# EAGLE design pixel32 (EAGLE 7.7.0)
SCALE: 1:1; SCHEMATIC_NAME: RECO0.16.018.01.00.00.E3; STUDENT: D. Palamarčuks; THESIS_SUPERVISOR: I. Galkins

## Sheet 1 of 2
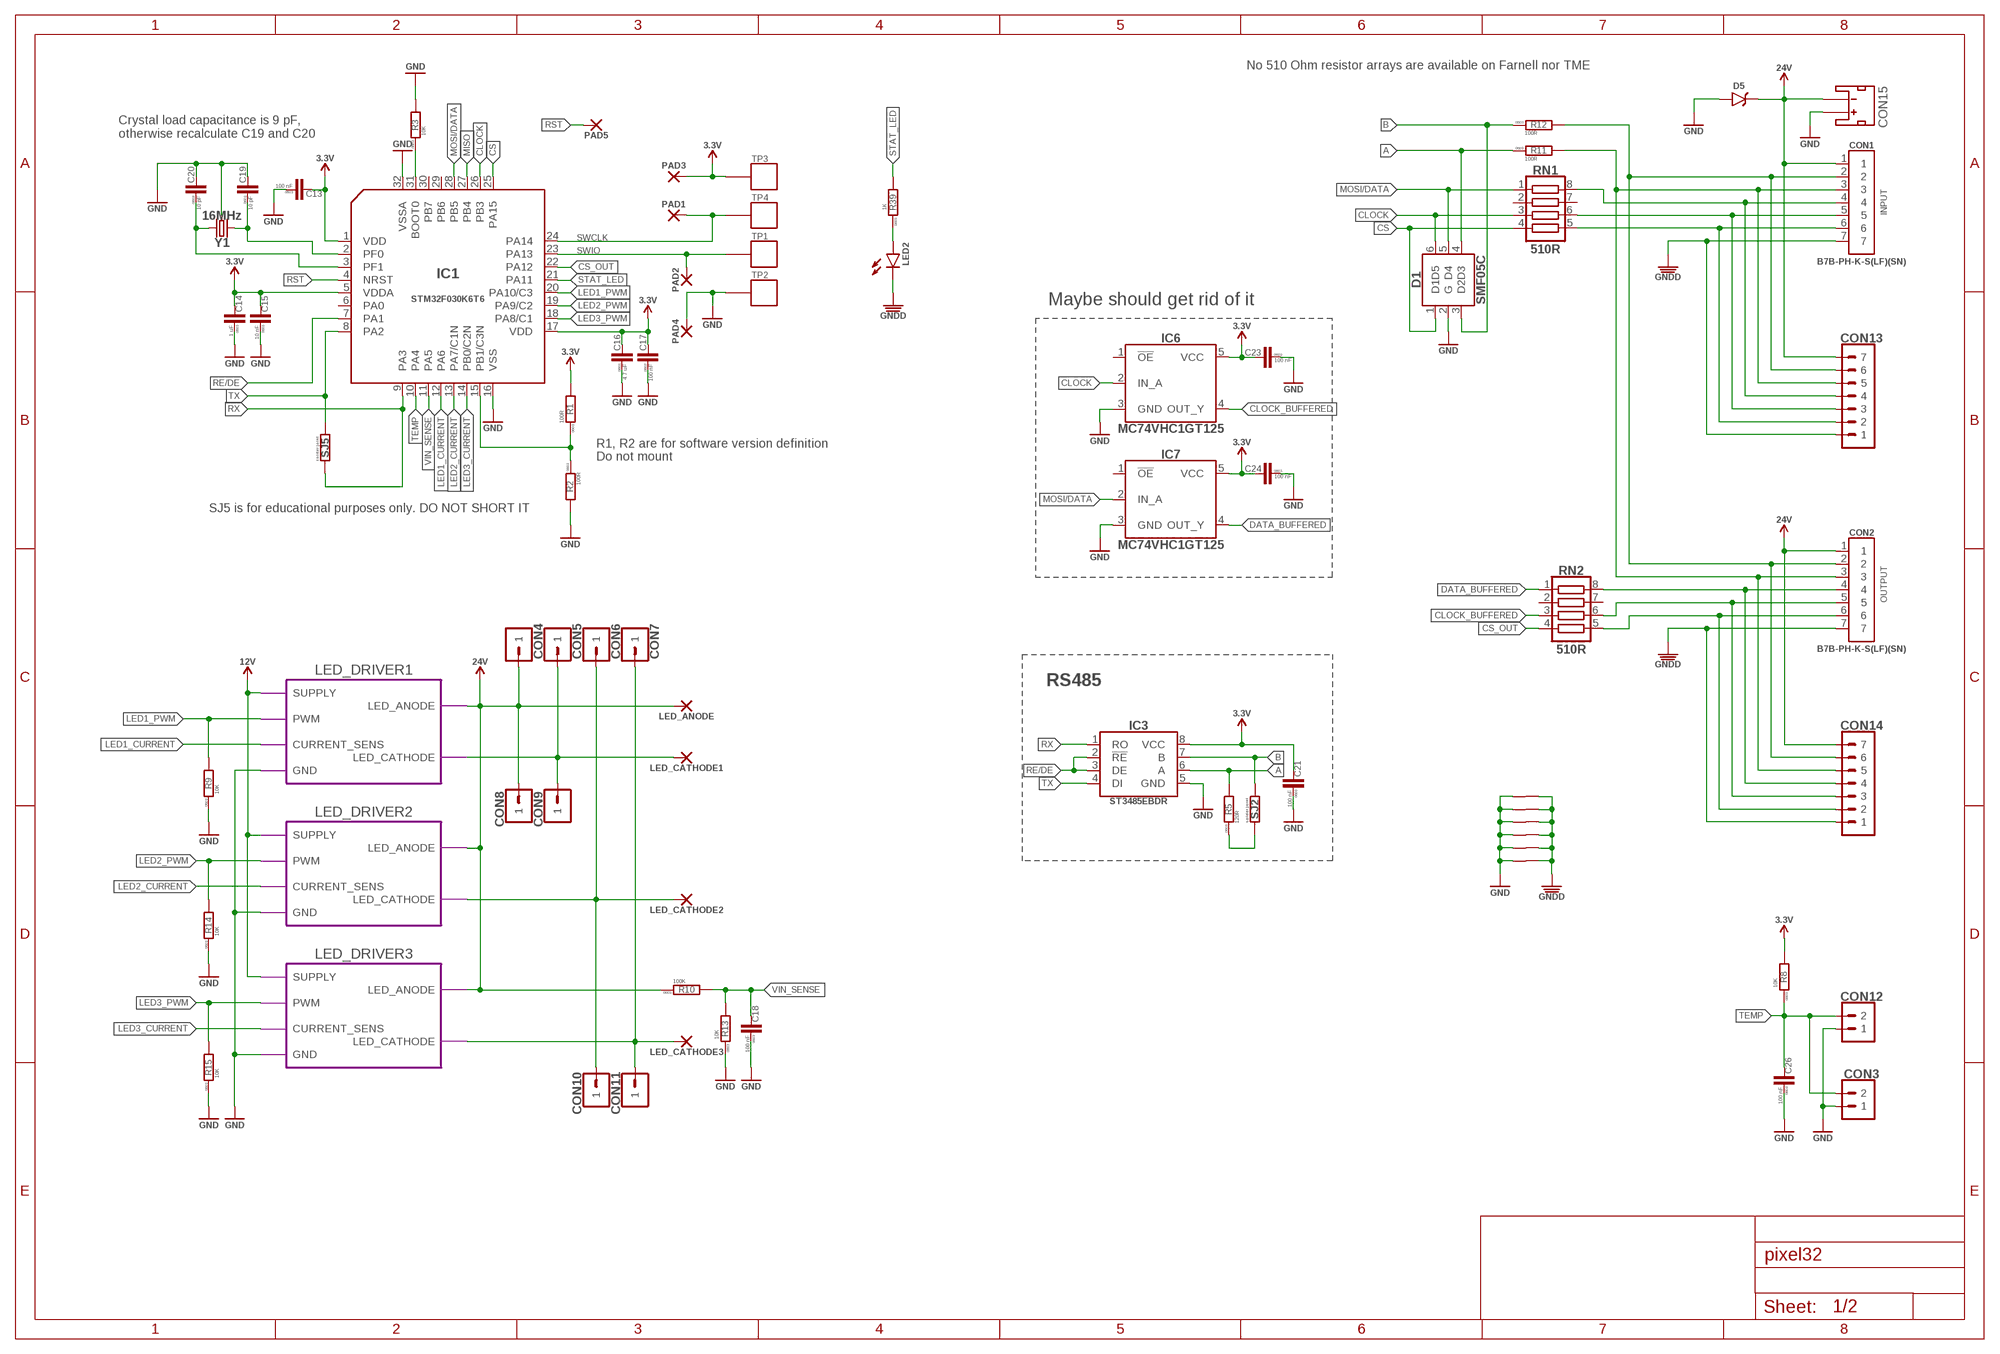
[diagram p0: schematic, sheet 1]

### Parts
C13  100 nF  C-0603  [C0603]
C14  1 uF  C-0603  [C0603]
C15  10 nF  C-0603  [C0603]
C16  4.7 uF  C-0603  [C0603]
C17  100 nF  C-0603  [C0603]
C18  100 nF  C-0603  [C0603]
C19  10 pF  C-0603  [C0603]
C20  10 pF  C-0603  [C0603]
C21  100 nF  C-0603  [C0603]
C23  100 nF  C-0603  [C0603]
C24  100 nF  C-0603  [C0603]
C26  100 nF  C-0603  [C0603]
CON1  B7B-PH-K-S-SIDE  [B7B-PH-K-S_SIDE]
CON2  B7B-PH-K-S-SIDE  [B7B-PH-K-S_SIDE]
CON3  PINHEAD_1X02-2.54  [1X02-PTH-2.54]
CON4  PINHEAD_1X01-2.54  [1X01-PTH-2.54]
CON5  PINHEAD_1X01-2.54  [1X01-PTH-2.54]
CON6  PINHEAD_1X01-2.54  [1X01-PTH-2.54]
CON7  PINHEAD_1X01-2.54  [1X01-PTH-2.54]
CON8  PINHEAD_1X01-2.54  [1X01-PTH-2.54]
CON9  PINHEAD_1X01-2.54  [1X01-PTH-2.54]
CON10  PINHEAD_1X01-2.54  [1X01-PTH-2.54]
CON11  PINHEAD_1X01-2.54  [1X01-PTH-2.54]
CON12  PINHEAD_1X02-2.54  [1X02-PTH-2.54]
CON13  PINHEAD_1X07-2  [1X07-PTH-2]
CON14  PINHEAD_1X07-2  [1X07-PTH-2]
CON15  B2B-PH-K-S  [B2B-PH-K-S_SIDE_MOUNT]
D1  SMF05C  [SC70_6L]
D5  TVS_DIODE-SMB  [SMB]
IC1  STM32F030K6TX-LQFP32(7X7)  [LQFP32-7X7]
IC3  ST3485SOIC8  [SOIC8]
IC6  MC74VHC1GT125  [SOT23-5]
IC7  MC74VHC1GT125  [SOT23-5]
LED2  LED-0603  [LED0603]
LED_ANODE  WIREPADSMD2.5-1.8  [PAD-2.5-1.8]
LED_CATHODE1  WIREPADSMD2.5-1.8  [PAD-2.5-1.8]
LED_CATHODE2  WIREPADSMD2.5-1.8  [PAD-2.5-1.8]
LED_CATHODE3  WIREPADSMD2.5-1.8  [PAD-2.5-1.8]
PAD1  WIREPADSMD2.5-1.8  [PAD-2.5-1.8]
PAD2  WIREPADSMD2.5-1.8  [PAD-2.5-1.8]
PAD3  WIREPADSMD2.5-1.8  [PAD-2.5-1.8]
PAD4  WIREPADSMD2.5-1.8  [PAD-2.5-1.8]
PAD5  WIREPADSMD2.5-1.8  [PAD-2.5-1.8]
R1  100R  R-0603  [R0603]
R2  100R  R-0603  [R0603]
R3  10K  R-0603  [R0603]
R5  120R  R-0603  [R0603]
R8  10K  R-0603  [R0603]
R9  10K  R-0603  [R0603]
R10  100K  R-0603  [R0603]
R11  100R  R-0603  [R0603]
R12  100R  R-0603  [R0603]
R13  10K  R-0603  [R0603]
R14  10K  R-0603  [R0603]
R15  10K  R-0603  [R0603]
R39  1K  R-0603  [R0603]
RN1  510R  RESISTOR_ARRAY  [CAT16-J4]
RN2  510R  RESISTOR_ARRAY  [CAT16-J4]
SJ2  SOLDER_JOINT  [RES_0]
SJ5  SOLDER_JOINT  [RES_0]
TP1  PAD.05  [PAD.05X.05]
TP2  PAD.05  [PAD.05X.05]
TP3  PAD.05  [PAD.05X.05]
TP4  PAD.05  [PAD.05X.05]
U$3  CONNECTION  [CONNECTION]
U$6  CONNECTION  [CONNECTION]
U$7  CONNECTION  [CONNECTION]
U$8  CONNECTION  [CONNECTION]
U$9  CONNECTION  [CONNECTION]
U$10  CONNECTION  [CONNECTION]
Y1  16MHz  CRYSTAL-3.2X2.5-4P  [OSCILLATOR-3.2X2.5]

### Module instances
LED_DRIVER1 = LED_DRIVER (part numbers offset by 100)
LED_DRIVER2 = LED_DRIVER (part numbers offset by 200)
LED_DRIVER3 = LED_DRIVER (part numbers offset by 300)

### Nets
A: D1.4(D3) IC3.6(A) R5.2 R11.1
B: D1.3(D2) IC3.7(B) R12.1 SJ2.1
CLOCK: D1.6(D5) IC1.26(PB3) IC6.2(IN_A) RN1.3
CLOCK_BUFFERED: IC6.4(OUT_Y) RN2.3
CS: D1.1(D1) IC1.25(PA15) RN1.4
CS_OUT: IC1.22(PA12) RN2.4
DATA_BUFFERED: IC7.4(OUT_Y) RN2.1
GND: C13.1 C14.1 C15.1 C16.1 C17.1 C18.1 C19.2 C20.2 C21.1 C23.1 C24.1 C26.1 CON3.1 CON12.1 CON15.1(+) D1.2(G) D5.A IC1.16(VSS) IC1.32(VSSA) IC3.5(GND) IC6.3(GND) IC7.3(GND) PAD4.P$1(P) R2.2 R3.2 R9.1 R13.1 R14.1 R15.1 TP2.P$1 U$3.P$2 U$6.P$2 U$7.P$2 U$8.P$2 U$9.P$2 U$10.P$2 Y1.2(GND) Y1.4(GND) ; port LED_DRIVER1.GND LED_DRIVER3.GND LED_DRIVER2.GND ; also sheet 2
GNDD: CON1.7 CON2.7 CON13.1 CON14.1 LED2.C U$3.P$1 U$6.P$1 U$7.P$1 U$8.P$1 U$9.P$1 U$10.P$1
LED1_CURRENT: IC1.12(PA6) ; port LED_DRIVER1.CURRENT_SENS
LED1_PWM: IC1.20(PA10/C3) R9.2 ; port LED_DRIVER1.PWM
LED2_CURRENT: IC1.13(PA7/C1N) ; port LED_DRIVER2.CURRENT_SENS
LED2_PWM: IC1.19(PA9/C2) R14.2 ; port LED_DRIVER2.PWM
LED3_CURRENT: IC1.14(PB0/C2N) ; port LED_DRIVER3.CURRENT_SENS
LED3_PWM: IC1.18(PA8/C1) R15.2 ; port LED_DRIVER3.PWM
MISO: IC1.27(PB4)
MOSI/DATA: D1.5(D4) IC1.28(PB5) IC7.2(IN_A) RN1.1
N$1: R5.1 SJ2.2
N$3: IC1.15(PB1/C3N) R1.1 R2.1
N$4: C19.1 IC1.2(PF0) Y1.1
N$6: IC1.31(BOOT0) R3.1
N$9: C20.1 IC1.3(PF1) Y1.3
N$10: CON5.1 CON9.1 LED_CATHODE1.P$1(P) ; port LED_DRIVER1.LED_CATHODE
N$11: CON1.4 CON13.4 RN1.8
N$12: CON1.5 CON13.3 RN1.6
N$13: CON1.6 CON13.2 RN1.5
N$14: CON2.4 CON14.4 RN2.8
N$15: CON2.5 CON14.3 RN2.6
N$19: CON2.6 CON14.2 RN2.5
N$21: CON6.1 CON10.1 LED_CATHODE2.P$1(P) ; port LED_DRIVER2.LED_CATHODE
N$22: LED2.A R39.1
N$23: CON7.1 CON11.1 LED_CATHODE3.P$1(P) ; port LED_DRIVER3.LED_CATHODE
RE/DE: IC1.7(PA1) IC3.2(!RE) IC3.3(DE)
RS485_A: CON1.2 CON2.2 CON13.6 CON14.6 R12.2
RS485_B: CON1.3 CON2.3 CON13.5 CON14.5 R11.2
RST: IC1.4(NRST) PAD5.P$1(P)
RX: IC1.9(PA3) IC3.1(RO) SJ5.2
STAT_LED: IC1.21(PA11) R39.2
SWCLK: IC1.24(PA14) PAD1.P$1(P) TP4.P$1
SWIO: IC1.23(PA13) PAD2.P$1(P) TP1.P$1
TEMP: C26.2 CON3.2 CON12.2 IC1.10(PA4) R8.1
TX: IC1.8(PA2) IC3.4(DI) SJ5.1
VDD_3V3: C13.2 C14.2 C15.2 C16.2 C17.2 C21.2 C23.2 C24.2 IC1.1(VDD) IC1.5(VDDA) IC1.17(VDD) IC3.8(VCC) IC6.5(VCC) IC7.5(VCC) PAD3.P$1(P) R1.2 R8.2 TP3.P$1 ; supply symbol labelled 3.3V ; also sheet 2
VDD_12V: port LED_DRIVER2.SUPPLY LED_DRIVER1.SUPPLY LED_DRIVER3.SUPPLY ; supply symbol labelled 12V ; also sheet 2
VDD_24V: CON1.1 CON2.1 CON4.1 CON8.1 CON13.7 CON14.7 CON15.2(-) D5.C LED_ANODE.P$1(P) R10.1 ; port LED_DRIVER1.LED_ANODE LED_DRIVER3.LED_ANODE LED_DRIVER2.LED_ANODE ; supply symbol labelled 24V ; also sheet 2
VIN_SENSE: C18.2 IC1.11(PA5) R10.2 R13.2
Unconnected: IC1.6(PA0) IC1.29(PB6) IC1.30(PB7) IC6.1(!OE) IC7.1(!OE) RN1.2 RN1.7 RN2.2 RN2.7

### Notes on the sheet
- No 510 Ohm resistor arrays are available on Farnell nor TME
- Crystal load capacitance is 9 pF,
  otherwise recalculate C19 and C20
- INPUT
- Maybe should get rid of it
- R1, R2 are for software version definition
- Do not mount
- SJ5 is for educational purposes only. DO NOT SHORT IT
- OUTPUT
- RS485

## Sheet 2 of 2: DC-DC converter
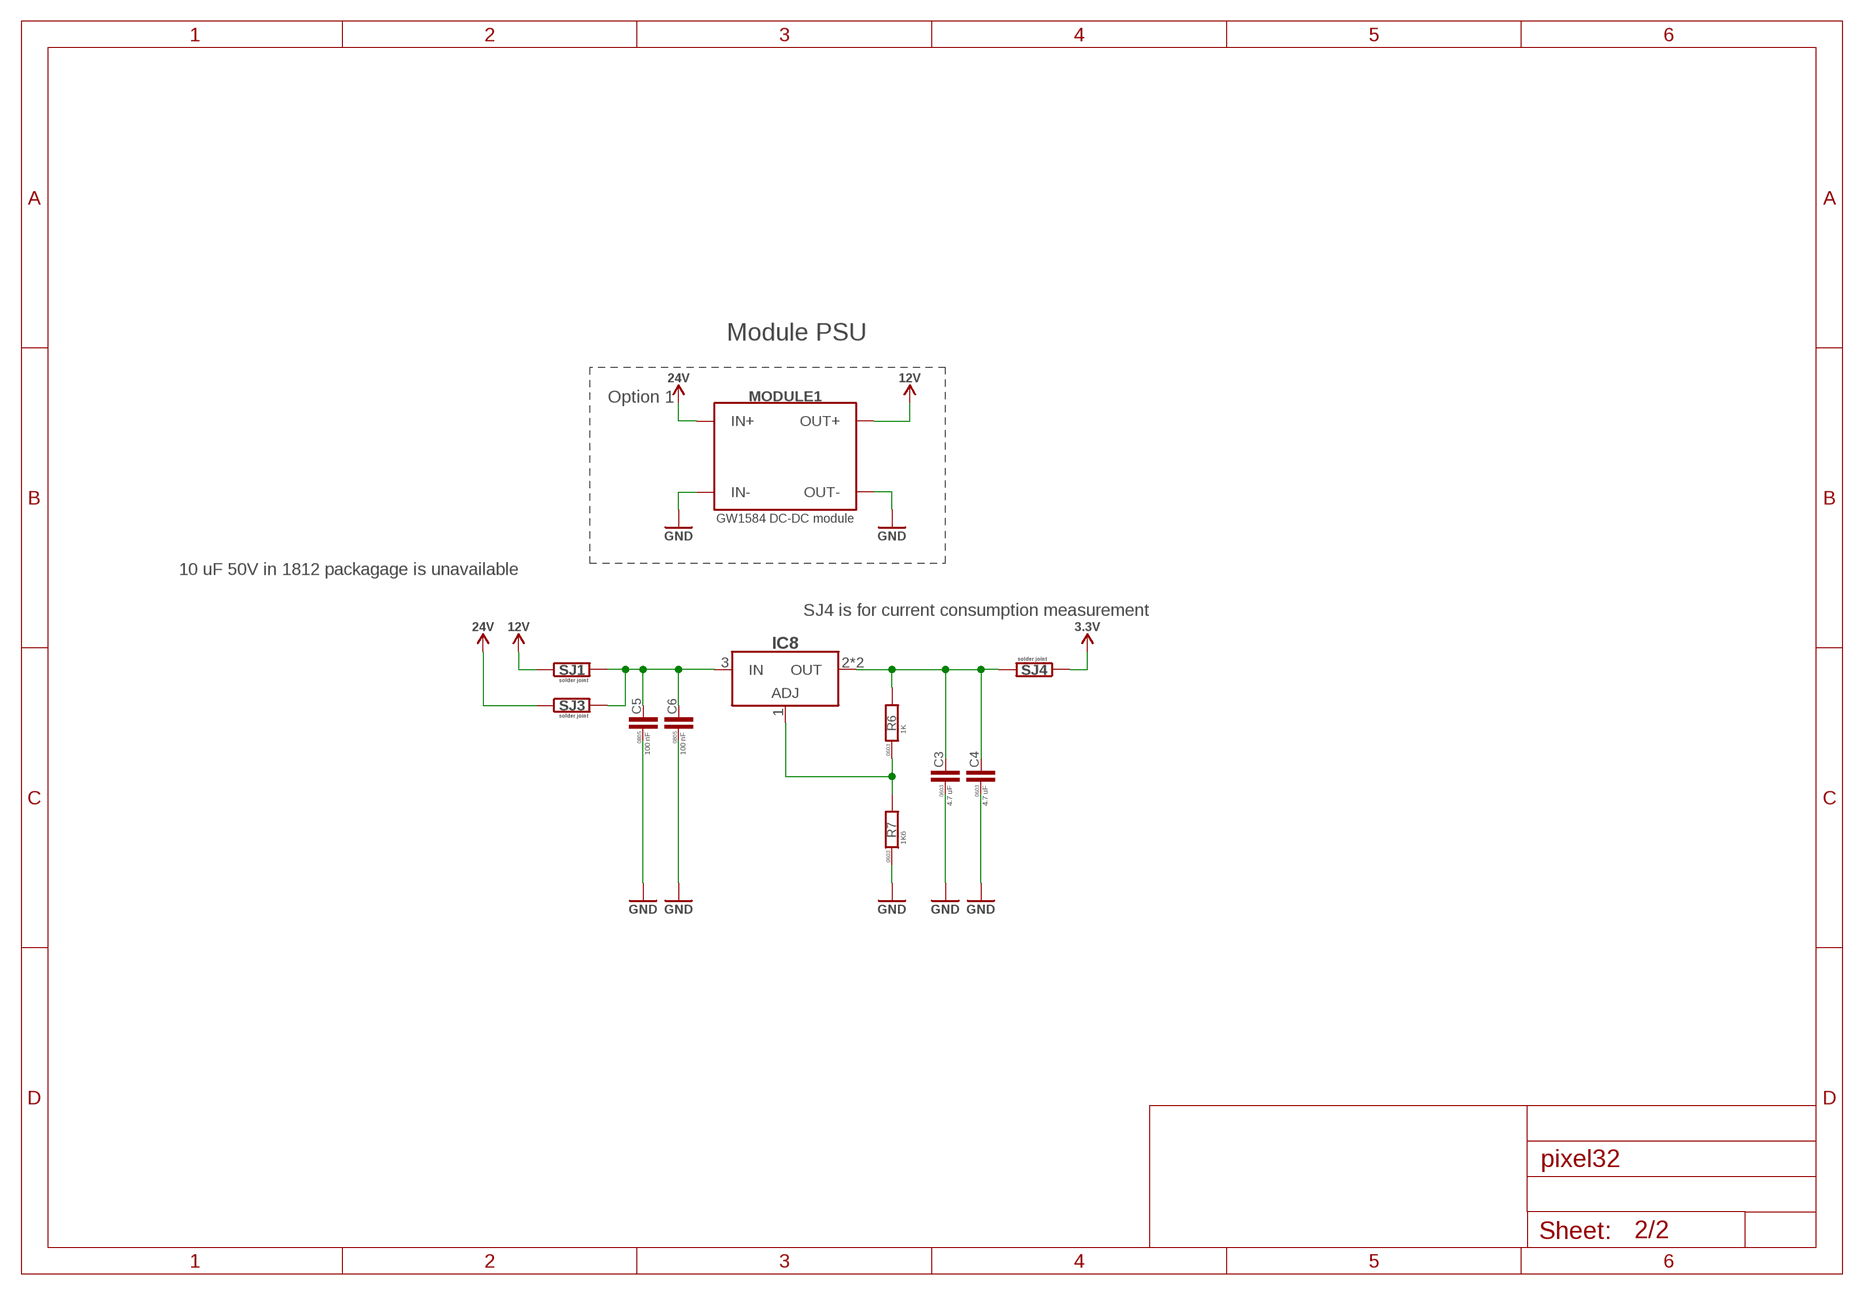
[diagram p1: schematic, sheet 2]

### Parts
C3  4.7 uF  C-0603  [C0603]
C4  4.7 uF  C-0603  [C0603]
C5  100 nF  C-0805  [C0805]
C6  100 nF  C-0805  [C0805]
IC8  LM317  [SOT223]
MODULE1  GW1584  [GW1584]
R6  1K  R-0603  [R0603]
R7  1K6  R-0603  [R0603]
SJ1  SOLDER_JOINT  [RES_0]
SJ3  SOLDER_JOINT  [RES_0]
SJ4  SOLDER_JOINT  [RES_0]

### Nets
GND: C3.1 C4.1 C5.1 C6.1 MODULE1.IN-@1(IN-) MODULE1.IN-@2(IN-) MODULE1.OUT-@1(OUT-) MODULE1.OUT-@2(OUT-) R7.1 ; also sheet 1
N$2: C3.2 C4.2 IC8.2(OUT) IC8.4(OUT) R6.2 SJ4.2
N$5: C5.2 C6.2 IC8.3(IN) SJ1.2 SJ3.2
N$20: IC8.1(ADJ) R6.1 R7.2
VDD_3V3: SJ4.1 ; supply symbol labelled 3.3V ; also sheet 1
VDD_12V: MODULE1.OUT+@1(OUT+) MODULE1.OUT+@2(OUT+) SJ1.1 ; supply symbol labelled 12V ; also sheet 1
VDD_24V: MODULE1.IN+@1(IN+) MODULE1.IN+@2(IN+) SJ3.1 ; supply symbol labelled 24V ; also sheet 1

### Notes on the sheet
- Module PSU
- Option 1
- 10 uF 50V in 1812 packagage is unavailable
- SJ4 is for current consumption measurement

## Library data of the parts
C3 C4 C16 = rc:C; FARNELL#: 2496930; PACKAGE: 0603; TME#: GRM188R60J475KE19D
C5 C6 = rc:C; FARNELL#: 2496834; PACKAGE: 0805; TME#: GRM188R71H104KA93D
C13 C17 C18 C21 C23 C24 C26 = rc:C; FARNELL#: 2496834; PACKAGE: 0603; TME#: GRM188R71H104KA93D
C14 = rc:C; FARNELL#: 2496917; PACKAGE: 0603; TME#: GRM188R61C105KA93D
C15 = rc:C; FARNELL#: 2496827; PACKAGE: 0603; TME#: C0603C103K3RAC
C19 C20 = rc:C; FARNELL#: 1414601; PACKAGE: 0603; TME#: GRM1885C1H100JA01D
CON1 CON2 = pixel_masterlib:B7B-PH-K-S: 7 Positions Header Connector 2.00mm, Through Hole, Side SMD; CHIPDIP#: 9000325603; DIGIKEY#: 455-1709-ND; FARNELL#: 9491864; MANF#: B7B-PH-K-S(LF)(SN); TME#: B7B-PH-K-S
CON3 CON12 = pinhead:PINHEAD_1X02: pinheader 2P
CON4-CON11 = pinhead:PINHEAD_1X01: pinheader 1P
CON13 CON14 = pinhead:PINHEAD_1X07: pinheader 7P
CON15 = led_matrix_master_lib:B2B-PH-K-S: CONN HEADER PH TOP 2POS 2MM
D1 = pixel_masterlib:SMF05C; CHIPDIP#: 9000048448; DIGIKEY#: SMF05CCT-ND; FARNELL#: 2059033; MANF: Semtech Corporation; MANF#: SMF05C.TCT; TME#: SMF05CT1G
D5 = pixel_masterlib:TVS_DIODE; CHIPDIP#: 8023193826; DIGIKEY#: 497-15658-2-ND; FARNELL#: 1749366; MANF: STMicroelectronics; MANF#: SMBJ26CA; TME#: SMBJ26CA-LF
IC1 = pixel_masterlib:STM32F030K6TX: MCU 32BIT 32KB FLASH 32LQFP; CHIPDIP#: 9000250493; DIGIKEY#: 497-14046-ND; FARNELL#: 2432085; MANF: STMicroelectronics; MANF#: STM32F030K6T6; TME#: STM32F030K6T6
IC3 = pixel_masterlib:ST3485: IC TXRX 3.3V RS485/422 8 SOIC; CHIPDIP#: 9000220421; DIGIKEY#: 497-2080-1-ND; FARNELL#: 2253266; MANF: STMicroelectronics; MANF#: ST3485EBDR; TME#: ST3485EBD
IC6 IC7 = pixel_masterlib:MC74VHC1GT125: Buffer, Non-Inverting 1 Element 1 Bit per Element Push-Pull Output 5-TSOP; CHIPDIP#: 9000014391; DIGIKEY#: MC74VHC1GT125DT1GOSDKR-ND; FARNELL#: 2101847; MANF: ON Semiconductor; MANF#: MC74VHC1GT125
IC8 = pixel_masterlib:LM317: Linear Voltage Regulator IC Positive Adjustable 1 Output 1.2 V ~ 37 V 500mA SOT-223; CHIPDIP#: LM317DCY; DIGIKEY#: 296-23224-5-ND; FARNELL#: 2112605; MANF: Texas Instruments; MANF#: LM317MSTT3G; TME#: LM317DCY
LED2 = rc:LED: SMD LED; CHIPDIP#: 8598509892; COLOR: GREEN; DIGIKEY#: 160-1446-1-ND; FARNELL#: 2293494; MANF: Lite-On Inc; MANF#: LTST-C191KGKT; TME#: LTST-C191KGKT
LED_ANODE LED_CATHODE1-LED_CATHODE3 PAD1-PAD5 = wirepad:WIREPAD: Wire PAD connect wire on PCB; BOM: EXCLUDE
MODULE1 = pixel_masterlib:GW1584: THIS http://mysku.ru/blog/aliexpress/35938.html http://ru.aliexpress.com/item/New-Mini-Converter-Adjustable-DC-DC-Step-down-Power-Supply-Module-replace-LM2596/32411413046.html?spm=2114.30010708.3.314.AhmzLw&s=p&ws_ab_test=searchweb201556_6,searchweb201602_5_10017_10010_10011_10018_10019_10036_10035_10034_301_507_10033_10032_10020_10001_10002_10005_10006_10021_10003_10022_10004_401_10009_10007_10008_2030013,searchweb201603_9&btsid=8a54b1af-cc82-4f8d-a784-d3b67147a089
R1 R2 = rc:R; ASSY: DO NOT MOUNT; PACKAGE: 0603
R3 R8 R9 R13-R15 = rc:R; FARNELL#: 2008341; PACKAGE: 0603; TME#: RC0603FR-0710K
R5 = rc:R; FARNELL#: 2303067; PACKAGE: 0603; TME#: CRCW0603120RFKTABC
R6 R39 = rc:R; FARNELL#: 2303145; PACKAGE: 0603; TME#: RC0603FR-071K
R7 = rc:R; FARNELL#: 2303159; PACKAGE: 0603; TME#: RC0603FR-071K6
R10 = rc:R; FARNELL#: 2303232; PACKAGE: 0603; TME#: RC0603FR-07100K
R11 R12 = rc:R; FARNELL#: 2303059; PACKAGE: 0603; TME#: RC0603FR-07100R
RN1 RN2 = pixel_masterlib:RESISTOR_ARRAY: Chip Resistor Array 4 Single Resistor; CHIPDIP#: 9000044911; DIGIKEY#: CAT16-511J4LF-ND; FARNELL#: 2321730; MANF: Bourns Inc; MANF#: CAT16-511J4LF
SJ1-SJ5 = eth_conv_master_lib:SOLDER_JOINT; BOM: EXCLUDE
TP1-TP4 = misc:PAD: Test pad This footprint includes three classes: The actual test pads, a pogo-pin footprint to mount the pogo-pin as through-hole part and a hole footprint which allows the head of the pogo-pin to pass through (do NOT use the hole to mount the pogo-pin). In a typical test setup, the stack would consist of three PCBs: The actual PCB under testing with a test pad on the bottom, then a second PCB with the hole for the pogo-pin head where the PCB under testing is pressed on and a third PCB at 30 mm / 1.2" distance with the pogo-pin footprints. The pogo-pins are soldered to the last PCB. To create the stack, copy the board under testing and exchange the footprints - this way the correct positioning is ensured.; BOM: EXCLUDE; PARTNO: *
U$3 U$6-U$10 = usb2can_master_lib:CONNECTION; BOM: EXCLUDE
Y1 = crystals:CRYSTAL: Smd Crystal; CHIPDIP#: 8596067027; DIGIKEY#: SER4069CT-ND; FARNELL#: 1712841; MANF: Epson; MANF#: X1E0000210013 TSX-3225 16 MHZ 9.0PF

## Module LED_DRIVER
Ports: GND(pwr) PWM(in) CURRENT_SENS(out) LED_ANODE(pwr) LED_CATHODE(pwr) SUPPLY(pwr)
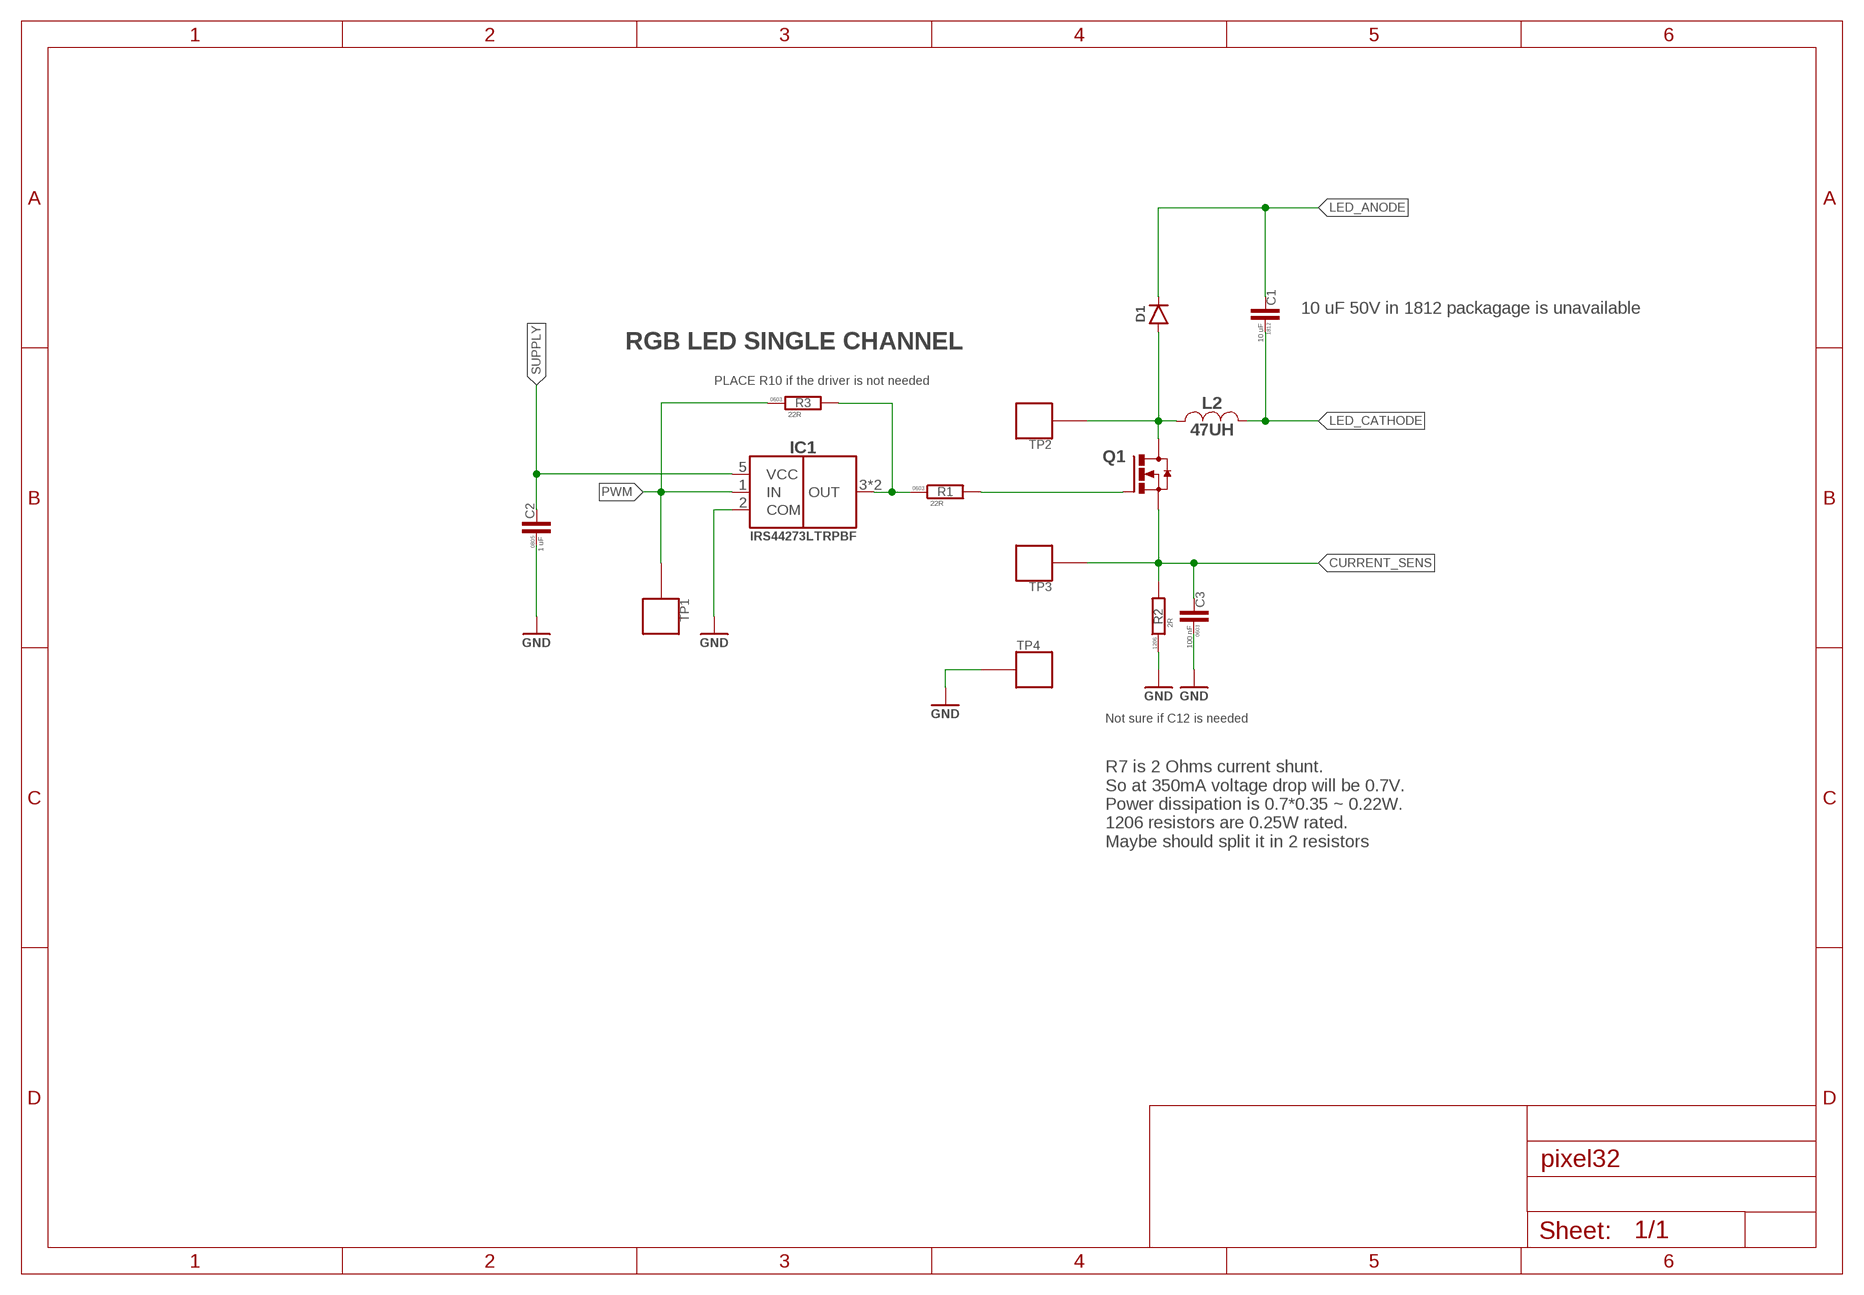
[diagram p2: schematic, module LED_DRIVER, sheet 1]

### Parts
C1  10 uF  C-1812  [C1812]
C2  1 uF  C-0805  [C0805]
C3  100 nF  C-0603  [C0603]
D1  DIODE-SOD123  [SOD123]
IC1  IRS44273L  [SOT23-5]
L2  47UH  INDUCTOR-470KL-SDR0805  [SDR0805]
Q1  N-FET-SOT23  [SOT23-3]
R1  22R  R-0603  [R0603]
R2  2R  R-R1206  [R1206]
R3  22R  R-0603  [R0603]
TP1  PAD.05  [PAD.05X.05]
TP2  PAD.05  [PAD.05X.05]
TP3  PAD.05  [PAD.05X.05]
TP4  PAD.05  [PAD.05X.05]

### Nets
CURRENT_SENS: C3.2 Q1.2(S) R2.P$2 TP3.P$1
GND: C2.1 C3.1 IC1.2(COM) R2.P$1 TP4.P$1
LED_ANODE: C1.P$2 D1.C
LED_CATHODE: C1.P$1 L2.2
N$2: D1.A L2.1 Q1.3(D) TP2.P$1
N$3: IC1.3(OUT) IC1.4(OUT) R1.1 R3.2
N$7: Q1.1(G) R1.2
PWM: IC1.1(IN) R3.1 TP1.P$1
SUPPLY: C2.2 IC1.5(VCC)

### Notes on the sheet
- 10 uF 50V in 1812 packagage is unavailable
- RGB LED SINGLE CHANNEL
- PLACE R10 if the driver is not needed
- Not sure if C12 is needed
- R7 is 2 Ohms current shunt. 
  So at 350mA voltage drop will be 0.7V. 
  Power dissipation is 0.7*0.35 ~ 0.22W. 
  1206 resistors are 0.25W rated. 
  Maybe should split it in 2 resistors

### Library data of the parts
C1 = rc:C; FARNELL#: 2449143; PACKAGE: 1812; TME#: CL32B106KBJNNNE
C2 = rc:C; FARNELL#: 1735541; PACKAGE: 0805; TME#: GRM21BR71H105KA12L
C3 = rc:C; FARNELL#: 2496834; PACKAGE: 0603; TME#: GRM188R71H104KA93D
D1 = pixel_masterlib:DIODE; CHIPDIP#: MBRS1100T3G; DIGIKEY#: MBRS1100T3GOSCT-ND; FARNELL#: 9555862; MANF: ON Semiconductor; MANF#: MBRS1100T3G; TME#: MBRS1100T3G
IC1 = pixel_masterlib:IRS44273L: Low-Side Gate Driver IC Non-Inverting SOT-23-5; CHIPDIP#: 9000204261; DIGIKEY#: IRS44273LTRPBFTR-ND; FARNELL#: 2580779; MANF: Infineon Technologies; MANF#: IRS44273LTRPBF; TME#: IRS44273LTRPBF
L2 = power_inductors:INDUCTOR: Unshielded Wirewound Inductor; CHIPDIP#: 8980699057; DIGIKEY#: SDR0805-470KLCT-ND; FARNELL#: 1828030; MANF: Bourns Inc; MANF#: SDR0805-470KL
Q1 = pixel_masterlib:N-FET; CHIPDIP#: 9000095041; DIGIKEY#: IRLML0040TRPBFCT-ND; FARNELL#: 1831088; MANF: Infineon Technologies; MANF#: IRLML0040TRPBF; TME#: IRLML0040TRPBF
R1 R3 = rc:R; FARNELL#: 2302996; PACKAGE: 0603; TME#: CRCW060322R0FKEA
R2 = rc:R; FARNELL#: 2502621; PACKAGE: 1206; TME#: RC1206FR-072R
TP1-TP4 = pixhawk2:PAD: Test pad This footprint includes three classes: The actual test pads, a pogo-pin footprint to mount the pogo-pin as through-hole part and a hole footprint which allows the head of the pogo-pin to pass through (do NOT use the hole to mount the pogo-pin). In a typical test setup, the stack would consist of three PCBs: The actual PCB under testing with a test pad on the bottom, then a second PCB with the hole for the pogo-pin head where the PCB under testing is pressed on and a third PCB at 30 mm / 1.2" distance with the pogo-pin footprints. The pogo-pins are soldered to the last PCB. To create the stack, copy the board under testing and exchange the footprints - this way the correct positioning is ensured.; BOM: EXCLUDE; PARTNO: *

## Net classes
4 USBpair: width 0.152 mm, drill 0.305 mm, clearance 0.152 mm

## Board
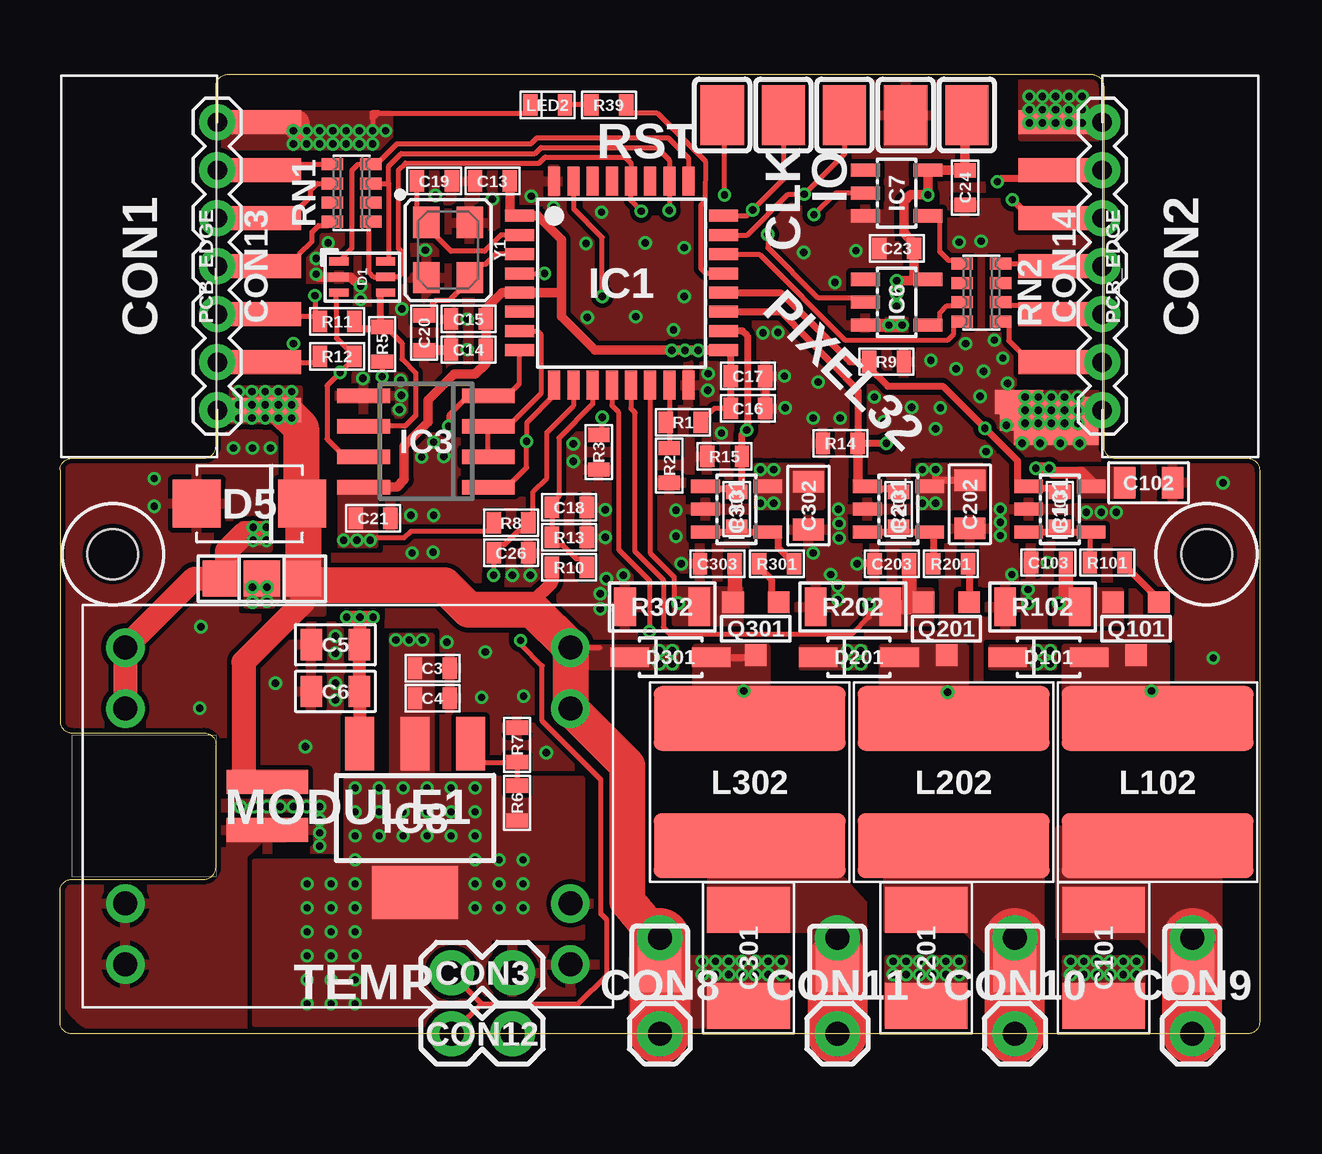
[diagram p3: board, top side]
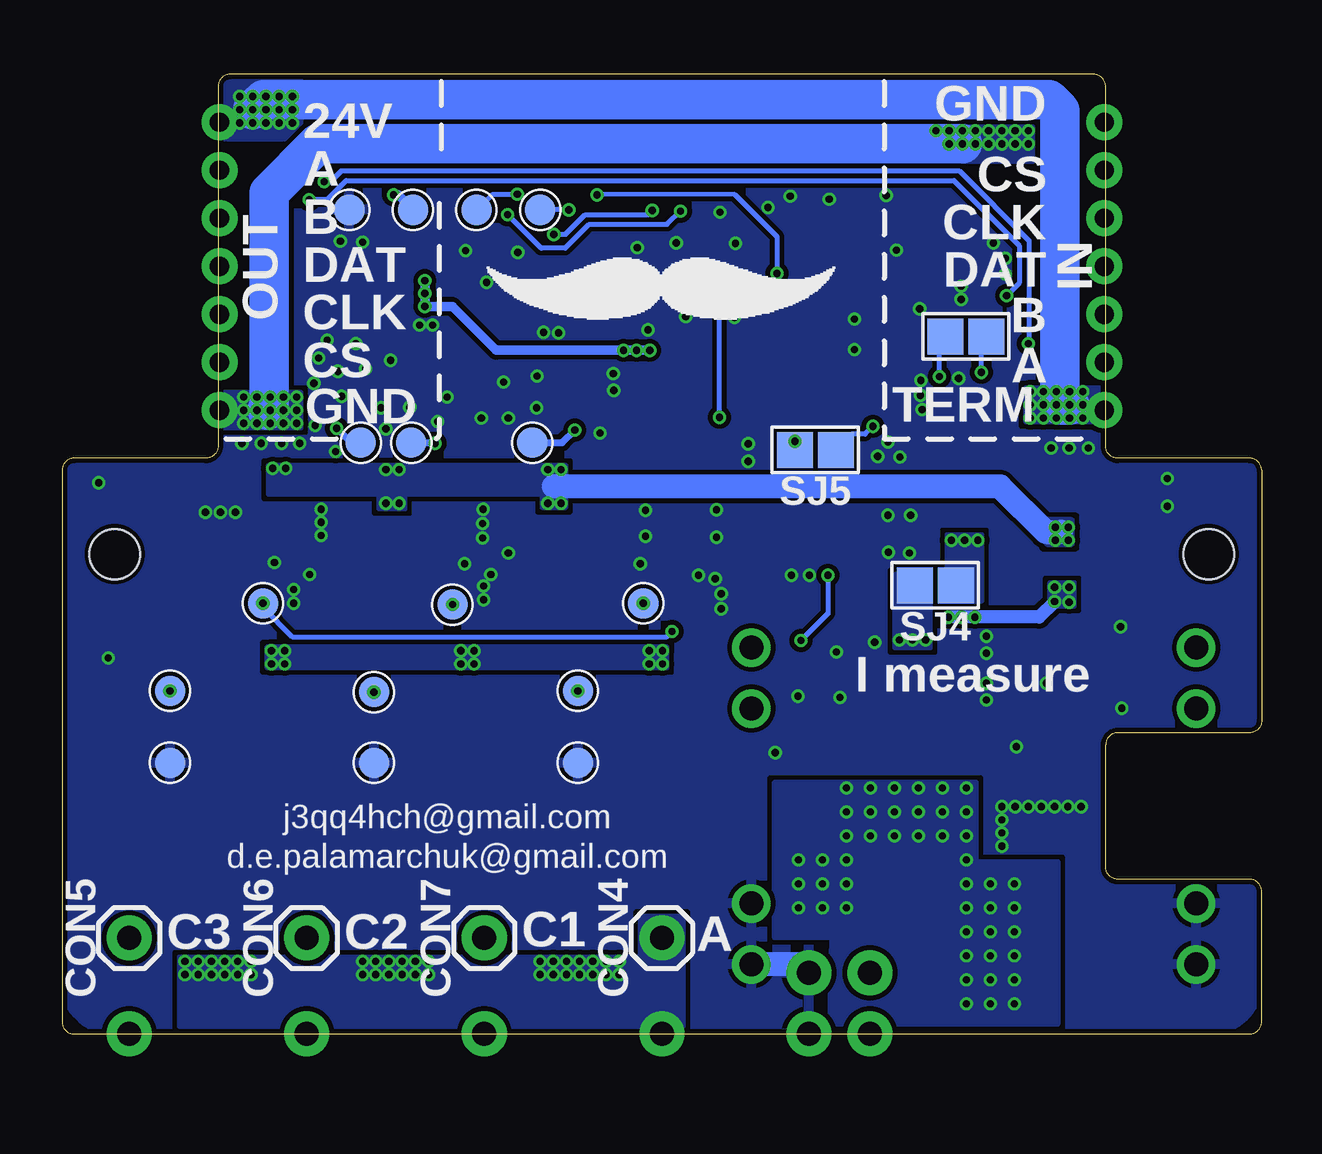
[diagram p4: board, bottom side, seen from below]

Size 50 x 40 mm. Coordinates in mm from the lower left corner, seen from the top.
Copper layers (1*16): Top 0.035mm / dielectric 0.5mm / Bottom 0.035mm
Design rules "design_rules *": minimum track width 0.2mm, minimum drill 0.2mm, track to track 0.2mm, track to pad 0.2mm, pad to pad 0.2mm, via to via 0.2mm, smd to smd 0.15mm, copper to edge 0.2mm, drill to drill 0.2mm, minimum pad ring 0.125mm, minimum via ring 0.125mm, stop-mask expansion 1mil, vias tented up to drill 0.31mm, thermal gap 8mil
tRestrict: 1 lines
Milling: 12 lines

### Footprints (pad centres in the part's own frame; a part is rotated, then mirrored left to right if it is on the bottom)
C0603 = smd 0.6 x 0.9: 1 -0.725,0; 2 0.725,0
C0805 = smd 0.9 x 1.3: 1 -1,0; 2 1,0
C1812 = smd 1.9 x 3.45: P$1 -2,0; P$2 2,0
B7B-PH-K-S_SIDE = smd 1 x 3: 1 -6,-0.25; 2 -4,-0.25; 3 -2,-0.25; 4 0,-0.25; 5 2,-0.25; 6 4,-0.25; 7 6,-0.25
1X02-PTH-2.54 = drill 1 pad 1.88: 1 -1.27,0; 2 1.27,0
1X01-PTH-2.54 = drill 1 pad 1.88: 1 0,0
1X07-PTH-2 = drill 0.8 pad 1.5: 1 -6,0; 2 -4,0; 3 -2,0; 4 0,0; 5 2,0; 6 4,0; 7 6,0
B2B-PH-K-S_SIDE_MOUNT = smd 1 x 3.4: 1 -1,-2.15; 2 1,-2.15
SC70_6L = smd 0.8 x 0.35: 1 -0.975,0.65; 2 -0.975,0; 3 -0.975,-0.65; 4 0.975,-0.65; 5 0.975,0; 6 0.975,0.65
SMB = smd 2 x 2: A -2.2,0; C 2.2,0
SOD123 = smd 1.6 x 0.8: A 1.7,0; C -1.7,0
LQFP32-7X7 = smd 1.2 x 0.5: 1 -4.25,2.8; 2 -4.25,2; 3 -4.25,1.2; 4 -4.25,0.4; 5 -4.25,-0.4; 6 -4.25,-1.2; 7 -4.25,-2; 8 -4.25,-2.8; 17 4.25,-2.8; 18 4.25,-2; 19 4.25,-1.2; 20 4.25,-0.4; 21 4.25,0.4; 22 4.25,1.2; 23 4.25,2; 24 4.25,2.8 | smd 0.5 x 1.2: 9 -2.8,-4.25; 10 -2,-4.25; 11 -1.2,-4.25; 12 -0.4,-4.25; 13 0.4,-4.25; 14 1.2,-4.25; 15 2,-4.25; 16 2.8,-4.25; 25 2.8,4.25; 26 2,4.25; 27 1.2,4.25; 28 0.4,4.25; 29 -0.4,4.25; 30 -1.2,4.25; 31 -2,4.25; 32 -2.8,4.25
SOIC8 = smd 2.2 x 0.6: 1 -2.6,1.905; 2 -2.6,0.635; 3 -2.6,-0.635; 4 -2.6,-1.905; 5 2.6,-1.905; 6 2.6,-0.635; 7 2.6,0.635; 8 2.6,1.905
SOT23-5 = smd 0.55 x 1.2: 1 -0.95,-1.3; 2 0,-1.3; 3 0.95,-1.3; 4 0.95,1.3; 5 -0.95,1.3
SOT223 = smd 1.219 x 2.235: 1 -2.311,-3.099; 2 0,-3.099; 3 2.311,-3.099 | smd 3.6 x 2.2: 4 0,3.099
SDR0805 = smd 2.7 x 8: 1 -2.65,0; 2 2.65,0
LED0603 = smd 0.6 x 0.9: A -0.725,0; C 0.725,0
PAD-2.5-1.8 = smd 1.8 x 2.5: P$1 0,0
GW1584 = drill 1 pad 1.6: IN+@1 9.271,6.604; IN+@2 9.271,4.064; IN-@1 9.271,-6.604; IN-@2 9.271,-4.064; OUT+@1 -9.271,6.604; OUT+@2 -9.271,4.064; OUT-@1 -9.271,-4.064; OUT-@2 -9.271,-6.604
SOT23-3 = smd 0.9 x 0.9: 1 -0.95,-1.1; 2 0.95,-1.1; 3 0,1.1
R0603 = smd 0.6 x 0.9: 1 -0.725,0; 2 0.725,0
R1206 = smd 0.9 x 1.6: P$1 -1.55,0; P$2 1.55,0
CAT16-J4 = smd 0.5 x 0.9: 1 -1.2,-0.8; 2 -0.4,-0.8; 3 0.4,-0.8; 4 1.2,-0.8; 5 1.2,0.8; 6 0.4,0.8; 7 -0.4,0.8; 8 -1.2,0.8
RES_0 = smd 1.5 x 1.5: 1 -0.85,0; 2 0.85,0
PAD.05X.05 = smd 1.27 x 1.27: P$1 0,0
CONNECTION = smd 1 x 1: P$1 -0.5,0; P$2 0.5,0
MOUNTING_HOLE_M2 = hole 2.1: 0,0
OSCILLATOR-3.2X2.5 = smd 1.3 x 1.1: 1 -1.15,-0.9; 2 1.15,-0.9; 3 1.15,0.9; 4 -1.15,0.9

### Placement (x,y rotation side)
C3  15.53,15.25 180 top
C4  15.53,14 180 top
C5  11.47,16.23 0 top
C6  11.47,14.28 0 top
C13  18.02,35.55 0 top
C14  17.02,28.52 0 top
C15  17.02,29.8 0 top
C16  28.68,26.07 180 top
C17  28.68,27.43 180 top
C18  21.23,21.95 180 top
C19  15.6,35.55 0 top
C20  15.18,29.23 270 top
C21  13.05,21.5 180 top
C23  34.88,32.75 0 top
C24  37.73,35.27 90 top
C26  18.8,20.05 180 top
C101  10 uF  [C1812]  43.5,3.18 270 top
C102  1 uF  [C0805]  45.38,22.98 180 top
C103  100 nF  [C0603]  41.2,19.65 0 top
C201  10 uF  [C1812]  36.1,3.18 270 top
C202  1 uF  [C0805]  37.92,22.07 90 top
C203  100 nF  [C0603]  34.67,19.6 0 top
C301  10 uF  [C1812]  28.7,3.18 270 top
C302  1 uF  [C0805]  31.2,22.02 90 top
C303  100 nF  [C0603]  27.4,19.6 0 top
CON1  8.3,32 90 top
CON2  41.7,32 270 top
CON3  17.6,2.55 180 top
CON4  25,4 90 bottom
CON5  47.2,4 90 bottom
CON6  39.8,4 90 bottom
CON7  32.4,4 90 bottom
CON8  25,0.01 0 top
CON9  47.2,0.01 0 top
CON10  39.8,0.01 0 top
CON11  32.4,0.01 0 top
CON12  17.6,0.01 180 top
CON13  6.56,32 270 top
CON14  43.44,32 90 top
CON15  6.5,9.5 90 top
D1  12.6,31.55 0 top
D5  7.9,22.1 0 top
D101  DIODE-SOD123  [SOD123]  41.2,15.7 0 top
D201  DIODE-SOD123  [SOD123]  33.3,15.7 0 top
D301  DIODE-SOD123  [SOD123]  25.45,15.7 0 top
DRILEGEND  [DRILEGEND]  -12.04,-13.2 0 top  (outside the outline)
IC1  23.4,31.3 0 top
IC3  15.25,24.7 180 top
IC6  34.88,30.5 270 top
IC7  34.88,35.05 270 top
IC8  14.8,9 180 top
IC101  IRS44273L  [SOT23-5]  41.67,21.88 270 top
IC201  IRS44273L  [SOT23-5]  34.95,21.88 270 top
IC301  IRS44273L  [SOT23-5]  28.2,21.88 270 top
L102  47UH  [SDR0805]  45.75,10.5 270 top
L202  47UH  [SDR0805]  37.25,10.5 270 top
L302  47UH  [SDR0805]  28.75,10.5 270 top
LED2  20.32,38.73 180 top
LED_ANODE  25,3 0 top
LED_CATHODE1  47.2,3 0 top
LED_CATHODE2  39.8,3 0 top
LED_CATHODE3  32.4,3 0 top
MODULE1  12,9.5 0 top
PAD1  30.15,38.3 0 top
PAD2  32.7,38.3 0 top
PAD3  37.8,38.3 0 top
PAD4  35.25,38.3 0 top
PAD5  27.6,38.3 0 top
Q101  N-FET-SOT23  [SOT23-3]  44.85,16.9 180 top
Q201  N-FET-SOT23  [SOT23-3]  36.95,16.9 180 top
Q301  N-FET-SOT23  [SOT23-3]  29,16.9 180 top
R1  25.98,25.5 0 top
R2  25.4,23.7 270 top
R3  22.45,24.25 270 top
R5  13.43,28.75 90 top
R6  19.05,9.62 270 top
R7  19.05,12.05 270 top
R8  18.8,21.3 180 top
R9  34.45,28.02 180 top
R10  21.23,19.45 0 top
R11  11.55,29.7 180 top
R12  11.55,28.25 180 top
R13  21.23,20.7 180 top
R14  32.52,24.62 0 top
R15  27.7,24.07 0 top
R39  22.88,38.73 0 top
R101  22R  [R0603]  43.65,19.65 0 top
R102  2R  [R1206]  40.95,17.8 0 top
R103  22R  [R0603]  41.67,21.88 270 top
R201  22R  [R0603]  37.12,19.6 0 top
R202  2R  [R1206]  33.05,17.8 0 top
R203  22R  [R0603]  34.95,21.88 270 top
R301  22R  [R0603]  29.88,19.6 180 top
R302  2R  [R1206]  25.1,17.8 0 top
R303  22R  [R0603]  28.2,21.88 270 top
RN1  12.15,35.05 90 top
RN2  38.4,30.9 270 top
SJ1  7.55,18.98 0 top
SJ2  12.32,29.07 180 bottom
SJ3  9.28,18.98 180 top
SJ4  13.6,18.7 180 bottom
SJ5  18.6,24.35 180 bottom
TP1  32.73,34.35 90 bottom
TP2  38.02,34.35 90 bottom
TP3  35.38,34.35 90 bottom
TP4  30.07,34.35 90 bottom
TP101  PAD.05  [PAD.05X.05]  37.55,24.65 270 bottom
TP102  PAD.05  [PAD.05X.05]  45.5,14.3 180 bottom
TP103  PAD.05  [PAD.05X.05]  41.62,17.95 180 bottom
TP104  PAD.05  [PAD.05X.05]  45.5,11.3 180 bottom
TP201  PAD.05  [PAD.05X.05]  35.45,24.65 270 bottom
TP202  PAD.05  [PAD.05X.05]  37,14.25 180 bottom
TP203  PAD.05  [PAD.05X.05]  33.73,17.9 180 bottom
TP204  PAD.05  [PAD.05X.05]  37,11.3 180 bottom
TP301  PAD.05  [PAD.05X.05]  30.4,24.65 270 bottom
TP302  PAD.05  [PAD.05X.05]  28.5,14.3 180 bottom
TP303  PAD.05  [PAD.05X.05]  25.77,17.95 180 bottom
TP304  PAD.05  [PAD.05X.05]  28.5,11.3 180 bottom
U$1  [MOUSTASHE]  32.5,29.4 0 bottom
U$2  [BOARD_OUTLINE]  25,20 0 top
U$3  40.17,25.65 180 top
U$4  [MOUNTING_HOLE_M2]  2.2,20 0 top
U$5  [MOUNTING_HOLE_M2]  47.8,20 0 top
U$6  39.98,26.35 180 top
U$7  41.25,25.55 270 top
U$8  40.25,25.55 270 top
U$9  42.25,25.55 270 top
U$10  42.77,25.55 270 top
Y1  16.18,32.67 270 top

### Tracks (layer width: path | path; a pad name or v marks a point on that pad's centre or on a via)
A
  Top 0.2: 13.43,29.45 R5.2 13.57,29.48 14.25,28.8 14.25,28.12 14.82,27.55 14.82,25.77 14.38,25.34 IC3.6
  Top 0.3: 13.65,29.35 R5.2 | D1.4 13.35,30.9 13.35,29.5 R5.2 | R11.1 12.28,29.4 13.43,29.4 R5.2
B  (via drill 0.3)
  Top 0.2: D1.3 11.5,30.82 11.5,30.65 11.53,29 R12.1 12.28,28.15 12.25,28.15 v11.68,27.57 11.12,27.02 11.12,24.8 11.86,24.07 IC3.7
  Bottom 0.2: v11.68,27.57 11.68,28.85 SJ2.1
CLOCK  (via drill 0.3)
  Top 0.2: 13.65,32.2 D1.6 13.7,32.2 13.7,35.45 | RN1.3 13.7,35.45 | v25.4,34.33 IC1.26 25.4,36.42 24.88,36.95 20.05,36.95 19.8,36.7 14.22,36.7 13.7,36.17 13.7,35.45 | v29.5,33.33 29.5,32.77 31.6,30.68 33.4,30.68 IC6.2
  Bottom 0.2: v25.4,34.33 25.57,34.15 28.2,34.15 29.02,33.33 v29.5,33.33
CLOCK_BUFFERED
  Top 0.2: IC6.4 36.67,29.55 36.67,30.05 36.98,30.35 37.6,30.35 RN2.3
CS
  Top 0.2: 13.18,36.25 RN1.4 | 12.68,36.25 RN1.4 | IC1.25 26.2,36.5 25.35,37.35 19.88,37.35 19.62,37.1 14.05,37.1 13.3,36.35 13.3,36.25 RN1.4 | D1.1 12.18,32.75 12.18,36 12.43,36.25 RN1.4
CS_OUT
  Top 0.2: IC1.22 27.68,32.48 29.18,32.48 32.73,28.93 37,28.93 37.25,29.18 37.25,29.7 RN2.4 37.52,29.7
DATA_BUFFERED
  Top 0.2: 36.55,34.1 IC7.4 36.33,33.95 36.67,33.95 36.67,32.6 37.02,32.25 37.45,32.25 RN2.1 37.25,32.1
GND  (via drill 0.3, 0.3 pad 0.55)
  Top 0.2: IC1.32 20.6,35.23
  Top 0.3: C203.1 v33.23,19.6 | C17.1 C16.1
  Top 0.4: v12.53,31.18 12.38,31.3 12.1,31.55 10.78,31.55 | C20.2 16.27,28.5
  Top 0.55: IC6.3 v34.55,29.55 v35.1,29.55
  Bottom 1: CON3.1 19.22,2.9 MODULE1.IN-@1
  other vias: 39.2,21.88 41.15,19.65 32.45,21.88 31.4,20.05 10.68,32.33 11.18,32.98 12.53,30.62 32.42,18.68 32.42,18.1 40.35,18.52 40.35,17.95 39.67,19.15 25.9,19.6 30.2,27.43 27.02,27.52 32.12,19.15 19.65,34.92 44.02,21.75 22.57,34.25 31.4,25.68 22.52,18.35 23.48,19.12 18.02,34.8 15.65,34.95 15.22,32.67 16.98,29.8 16.98,28.52 21.4,23.88 25.68,20.75 25.68,21.82 42.77,21.75 43.4,21.75 27.57,25.05 27,26.82 14.22,26.62 14.15,26.02 14.2,27.25 15.57,24.68 3.93,22 3.93,23.15 20.57,34.45 22.52,17.73 39.2,20.77 30.23,26.1 8.02,24.43 48.48,22.98 31,32.58 32.3,31.32 33.17,32.65 14.25,30.23 15.07,24.05 16,24.07 14.62,21.62 15.57,21.62 32.48,21.27 32.48,20.68 39.2,21.32 25.57,29.35 21.98,29.88 35.5,26.12 36.5,25.23 33.95,26.55 36.7,26.1 22.73,21.85 22.73,20.7 22.77,18.98 21.4,24.6 29.3,29.23 29.93,29.25 26.02,32.77 32.52,25.68 12.62,27.32 37.48,33 38.4,33.05 7.23,24.43 8.77,24.43 18.85,19.12 19.6,19.12 14.68,20.05 15.55,20.07 10.68,31.68 48.08,15.68 21.93,32.95 24,29.9 24.4,32.98 26.02,30.75 39.45,25.38 39.5,27.12 39.3,28.18 38.95,28.93 38.5,27.62 37.35,27.73 38.35,26.57 37.75,28.77 36.3,28.07 42.5,24.62 41.7,24.62 40.85,24.62 40.1,24.62 34.35,25.52 31.6,27.18 38.6,24.27 11.47,13.93 11.47,14.62 11.47,15.88 11.47,16.57 7.52,9.47 8.07,9.47 8.62,9.47 9.18,9.47 9.72,9.47 10.28,9.47 10.82,9.47 10.82,8.93 10.82,8.38 10.82,7.82 8.98,14.62 10.22,11.97 5.82,13.57 5.88,16.98 17.73,15.93 17.57,14.03 19.32,14.07 16.12,16.32 20.27,11.72
  pour Bottom (isolate 0.2, rank 6): 50,2.5 50,37.5 arc90 47.5,40 2.5,40 arc90 0,37.5 0,2.5 arc90 2.5,0 47.5,0 arc90
  pour Top (rank 6): 0,2.5 0,37.5 arc-90 2.5,40 47.5,40 arc-90 50,37.5 50,2.5 arc-90 47.5,0 2.5,0 arc-90
  pour Top (no thermals): 34.45,37.35 36.05,37.35 36.08,36.73 34.67,35.55 34.67,32.02 32.17,32.02 32.17,33.75 32.7,34.27 34.45,34.27
  pour Top (no thermals): 9.4,8.1 9.4,8.9 7,8.9 7,6.9 7.7,6.9 7.7,7 7.7,7.4 8,7.7 8.4,8.1
GNDD  (via drill 0.3)
  Top 0.2: 13.03,38.15 v13.03,37.65 | 13.18,38.3 13.03,38.15 | 13.3,38.4 13,38.4 | 13.03,38.15 13.03,38.38 19.6,38.38 LED2.C
  Top 1: CON14.1 41.42,26 41.4,26.02 | CON13.1 9.9,38 9.9,37.7
  Bottom 0.3: 41.05,34.67 41.38,35
  Bottom 1.65: v12.47,37.1 39.35,37.1 41.38,35.08 41.38,35 41.38,26.07 CON2.7
  other vias: 11.38,37.65 9.72,37.1 10.28,37.1 10.82,37.1 11.38,37.1 11.93,37.1 11.93,37.65 10.82,37.65 10.28,37.65 9.72,37.65 40.23,26 41.33,25.45 41.88,25.45 42.42,25.45 40.23,25.45 40.77,25.45 40.77,26 40.23,26.55 40.77,26.55 42.42,26.55 42.42,26 41.88,26 41.33,26 41.33,26.55 41.88,26.55 12.47,37.65 13.03,37.1 13.57,37.65
  pour Top (no thermals): 6.65,38.4 13.78,38.4 13.78,36.92 6.65,36.92
  pour Bottom (no thermals): 13.75,37.83 9.55,37.83 9.55,36.35 13.75,36.35
  pour Top (no thermals): 40.17,26.75 43.4,26.75 43.4,25.25 40.17,25.25
  pour Bottom (no thermals): 43.4,26.75 40.05,26.75 40.05,25.25 43.4,25.25
LED1_CURRENT  (via drill 0.3)
  Top 0.2: C103.2 41.92,19.8 | IC1.12 23,26.2 23.3,25.9 23.3,20.18 24.57,18.9 v24.57,16.77
  Top 0.3: R102.P$2 42.67,17.98 | Q101.2 43.7,17.8
  Top 0.6: C103.2 41.92,17.8
  Bottom 0.2: v24.57,16.77 24.8,16.55 40.4,16.55 41.62,17.77 TP103.P$1
  other vias: 41.62,17.95
  pour Top (no thermals): 41.45,18.5 41.45,17.1 44.25,17.1 44.25,18.5
LED1_PWM  (via drill 0.3)
  Top 0.3: R103.1 41.55,22.73 40.38,22.73 IC101.1 39.92,22.82 39.92,23.88 v38.55,25.25 36.8,27 34.5,27 33.73,27.77 R9.2 32.92,28.02 30.05,30.9 IC1.20
  Bottom 0.3: TP101.P$1 37.25,24.65 | 37.45,24.65 TP101.P$1 | TP101.P$1 37.95,24.65 v38.55,25.25
LED2_CURRENT  (via drill 0.3)
  Top 0.2: C203.2 35.4,19.75 | IC1.13 23.8,26.07 23.98,25.9 23.98,20.1 25.15,18.93 25.15,16.95 25.43,16.68 33.02,16.68 33.73,17.38 TP203.P$1
  Top 0.6: C203.2 35.4,17.8 R202.P$2 34.6,17.75
  other vias: 33.73,17.9
  pour Top (no thermals): 33.55,18.5 33.55,17.1 36.35,17.1 36.35,18.5
LED2_PWM  (via drill 0.3)
  Top 0.3: IC201.1 33.75,22.73 34.95,22.73 R203.1 | IC1.19 30.05,30.1 33.25,26.85 R14.2 v34.45,24.62
  Top 0.4: R14.2 33.25,22.82 IC201.1
  Bottom 0.3: v34.45,24.62 35.42,24.62 TP201.P$1
LED3_CURRENT  (via drill 0.3)
  Top 0.2: C303.2 28.12,19.27 | Q301.2 28.05,18.2 28.12,18.2 | 26.32,18.5 26.65,18.18 R302.P$2 | 25.82,18 TP303.P$1 25.6,17.95 25.6,19.05 24.6,20.05 IC1.14
  Top 0.6: C303.2 28.12,18
  other vias: 25.77,17.95
  pour Top (no thermals): 25.6,18.55 25.6,17.1 28.4,17.1 28.4,18.55
LED3_PWM  (via drill 0.3)
  Top 0.2: 26.88,22.85 IC301.1
  Top 0.3: IC301.1 27,22.73 28.2,22.73 R303.1 | IC1.18 28.45,29.3 28.65,29.1 28.65,25.2 v28.62,25.18 28.43,24.98 R15.2 28.43,22.82 R303.1 | 27.93,22.6 R303.1
  Bottom 0.3: TP301.P$1 29.15,24.65 v28.62,25.18
LED_DRIVER1:N$2  (via drill 0.3)
  Top 0.3: L102.1 44.85,13.15
  other vias: 45.5,14.3
  pour Top (rank 3, no thermals): 46.17,12.32 46.17,16.15 41.85,16.15 41.85,12.32
LED_DRIVER1:N$3
  Top 0.2: IC101.4 42.92,20.88 R101.1
  Top 0.3: IC101.3 41.67,20.93 | 41.67,20.93 IC101.4 | R103.2 41.67,20.93
LED_DRIVER1:N$7
  Top 0.3: R101.2 44.38,19.52 45.8,18.1 Q101.1
LED_DRIVER2:N$2  (via drill 0.3)
  Top 0.3: L202.1 36.95,13.2
  other vias: 37,14.25
  pour Top (no thermals): 37.8,12.32 37.8,16.15 34.23,16.15 34.23,12.32
LED_DRIVER2:N$3
  Top 0.3: IC201.3 34.95,20.93 | 34.95,20.93 IC201.4 36.42,20.75 36.42,19.6 R201.1 | R203.2 34.95,20.93
LED_DRIVER2:N$7
  Top 0.2: 37.9,19.6 R201.2
  Top 0.3: 37.7,19.6 R201.2 | 37.9,19.6 Q201.1
LED_DRIVER3:N$2  (via drill 0.3)
  Top 0.3: 28.95,15.75 Q301.3 29,15.7 D301.A
  other vias: 28.5,14.3
  pour Top (no thermals): 29.52,12.32 29.52,16.15 26.45,16.15 26.45,12.32
LED_DRIVER3:N$3
  Top 0.3: R301.1 29.95,20.25 29.95,20.93 IC301.4 28.15,20.93 | IC301.3 28.15,20.93 | R303.2 28.2,20.98 28.15,20.93
LED_DRIVER3:N$7
  Top 0.3: R301.2 29.15,19.45 29.65,18.95 29.65,18 Q301.1
MOSI/DATA  (via drill 0.3)
  Top 0.2: v24.23,34.3 23.8,34.73 IC1.28 23.8,36.3 23.55,36.55 20.23,36.55 19.98,36.3 14.4,36.3 14.1,36 14.1,32.75 14.3,32.55 14.3,31.75 14.1,31.55 D1.5 13.07,31.55 12.88,31.75 12.88,33.77 RN1.1 | 33.4,34.88 IC7.2 32.35,35.05 v31.43,34.15
  Bottom 0.2: v24.23,34.3 24.77,33.75 28.02,33.75 29.02,32.75 30.02,32.75 v31.43,34.15
N$1  (via drill 0.3)
  Top 0.2: R5.1 v13.43,27.4
  Bottom 0.2: v13.43,27.4 13.43,28.82 SJ2.2
N$2  (via drill 0.3)
  other vias: 14,16.43 14.55,16.43 15.1,16.43 12.3,10.25 13.3,10.25 14.3,10.25 15.3,10.25 16.3,10.25 17.3,10.25 12.3,9.25 13.3,9.25 14.3,9.25 15.3,9.25 16.3,9.25 17.3,9.25 12.3,8.25 13.3,8.25 14.3,8.25 15.3,8.25 16.3,8.25 12.3,7.25 10.3,1.25 10.3,2.25 10.3,3.25 10.3,4.25 10.3,5.25 10.3,6.25 11.3,1.25 11.3,2.25 11.3,3.25 11.3,4.25 11.3,5.25 11.3,6.25 12.3,1.25 12.3,2.25 12.3,3.25 12.3,4.25 12.3,5.25 12.3,6.25 17.3,5.25 17.3,6.25 17.3,7.25 17.3,8.25 18.3,5.25 18.3,6.25 18.3,7.25 19.3,5.25 19.3,6.25 19.3,7.25
  pour Bottom (no thermals): 15.3,19.15 15.3,16.1 13.8,16.1 13.8,19.15
  pour Top (no thermals): 13.8,16.6 13.8,8.65 15.53,8.65 15.53,16.6
  pour Top (no thermals): 8.1,0.4 18,0.4 17.9,4 21.8,4 21.8,10.65 11.9,10.65 11.9,7.2 8.1,7.2
  pour Bottom (no thermals): 8.5,0.4 18,0.4 17.9,4 20.3,4 20.3,10.5 11.9,10.5 11.9,7.2 8.5,7.2
N$3
  Top 0.2: 25.23,25.48 R1.1 25.4,25.65 | 25.4,25.65 R2.1 25.4,24.4 | IC1.15 25.4,25.65
N$4
  Top 0.2: IC1.2 18.38,33.3 17.7,32.62 16.3,32.62 15.28,33.65 Y1.1 | 15.6,33.83 Y1.1 | Y1.1 14.88,34.23 C19.1
N$5  (via drill 0.3)
  Top 0.406: SJ1.2 SJ3.2
  Top 0.55: v12.5,17.38 12.5,16.25 C5.2 C6.2 12.49,14.26 12.49,12.68 | v12.5,17.38 v13.05,17.38 | v11.95,17.38 v12.5,17.38
  Top 0.9: IC8.3 12.49,12.68
  Bottom 0.55: v8.62,18.02 9.28,17.38 v13.05,17.38
  other vias: 8.02,18.62 8.62,18.62 8.02,18
  pour Top (no thermals): 9.07,19.62 9.07,17.82 7.75,17.82 7.75,19.62
  pour Bottom (no thermals): 7.82,18.82 7.82,17.82 8.82,17.82 8.82,18.82
N$6  (via drill 0.3)
  Top 0.2: R3.1 22.6,24.98 v22.6,25.7 | v22.6,30.75 22.6,33.2 21.43,34.38 IC1.31
  Bottom 0.2: v22.6,25.7 v22.6,30.75
N$9
  Top 0.2: IC1.3 18.15,32.5 17.73,32.08 17.55,32.08 17.07,31.6 Y1.3 | Y1.3 17.02,31.2 16.85,31.2 16.23,30.57 15.65,30.57 15.53,30.45 15.53,29.95 C20.1 | 17.02,31.4 Y1.3 | 15.18,30.02 C20.1 | 15.3,29.95 C20.1 | 15.2,29.95 C20.1
N$10
  Top 2.5: CON9.1 CON5.1
  pour Top (no thermals): 41.6,4 41.6,8.6 48.35,8.6 48.35,2.52 46.5,2.52 45.02,4
N$11
  Top 0.2: CON1.4 9.95,32 9.95,32.48 10.5,33.02 10.5,33.42 10.78,33.7 11.2,33.7 RN1.8
  Top 1: CON13.4 CON1.4
N$12
  Top 0.2: CON1.5 9.55,34 10.45,34.9 10.45,35.17 10.72,35.45 RN1.6
  Top 1: CON13.3 CON1.5
N$13
  Top 0.2: CON1.6 8.55,36.25 RN1.5
  Top 1: CON13.2 CON1.6
N$14
  Top 0.2: 40.4,32 40.9,32 | 40.9,32 CON2.4 | RN2.8 40.9,32.1 40.9,32
  Top 1: CON2.4 CON14.4
N$15
  Top 0.2: CON2.5 40.38,30 40,30.38 39.33,30.38 RN2.6
  Top 1: CON2.5 CON14.3
N$19
  Top 0.2: 41.17,28.27 CON2.6 40.45,28 39.55,28.9 39.55,29.7 RN2.5
  Top 1: CON2.6 CON14.2
N$20
  Top 0.2: R6.1 R7.2 17.11,11.32 IC8.1
N$21
  Top 0.3: L202.2 38.6,7.85
  Top 2.5: CON10.1 CON6.1
  pour Top (no thermals): 34.4,7.95 34.4,4.32 37.73,4.32 39.33,2.73 40.95,2.73 40.95,4.38 40.95,9.1 35.9,9.1 34.4,9.1 34.4,7.97
N$22
  Top 0.2: R39.1 LED2.A
N$23
  Top 2.5: LED_CATHODE3.P$1 CON11.1
  pour Top (no thermals): 27.07,9.1 27.07,4.32 31.25,4.32 31.25,2.7 33.55,2.7 33.55,5.47 32.45,6.68 32.45,9.1
RE/DE
  Top 0.2: IC3.2 IC3.3 18.81,25.34 18.81,25.51 18.86,25.51 20.05,26.7 20.05,29.15 19.9,29.3 IC1.7
RS485_A  (via drill 0.3)
  Top 0.2: 41.2,35.75 CON2.2 | v9.72,28.77 9.72,27.98 | CON1.2 9.2,28 9.72,27.98 | 9.72,27.98 10.55,27.98 R12.2
  Top 0.3: 41.2,35.75 41.2,35.65 39.2,35.65 v39.08,35.52
  Top 1: CON14.6 CON2.2 | CON1.2 CON13.6
  Bottom 0.2: v39.08,35.52 38.8,35.52 38.35,35.98 12.6,35.98 9.7,33.08 9.7,28.8 v9.72,28.77
RS485_B  (via drill 0.3)
  Top 0.2: 8.55,30.32 CON1.3 9.55,30 9.72,30.15 9.97,29.9 10.62,29.9 | v10.62,30.77 10.62,29.9 | 10.62,29.9 R11.2
  Top 0.3: CON2.3 40.48,34 v39.7,34.77
  Top 1: CON2.3 CON14.5 | CON1.3 CON13.5
  Bottom 0.2: v39.7,34.77 38.95,34.77 38.15,35.58 12.82,35.58 10.1,32.85 10.1,31.3 v10.62,30.77
RST  (via drill 0.3)
  Top 0.2: IC1.4 v20.2,31.7 | v27.7,34.98 27.7,38.2 PAD5.P$1
  Bottom 0.2: v27.7,34.98 21.98,35 20.2,33.23 v20.2,31.7
RX  (via drill 0.3)
  Top 0.2: IC1.9 20.6,26.62 19.45,25.48 v19.45,24.7 19.45,23.6 18.64,22.8 IC3.1
  Bottom 0.2: SJ5.2 v19.45,24.7
STAT_LED
  Top 0.2: IC1.21 26.93,31.7 26.73,31.9 26.73,34.55 26.9,34.73 26.93,36.35 24.9,38.38 23.6,38.38 R39.2
SWCLK  (via drill 0.3)
  Top 0.2: IC1.24 28.62,34.1 v28.88,34.35 30.15,35.62 PAD1.P$1
  Bottom 0.2: v28.88,34.35 TP4.P$1
SWIO  (via drill 0.3)
  Top 0.2: IC1.23 28.65,33.3 30.35,35 v31.02,35 32.7,36.67 PAD2.P$1
  Bottom 0.2: TP1.P$1 32.05,35 v31.02,35
TEMP  (via drill 0.3)
  Top 0.2: IC1.10 21.4,26.18 20.3,25.07 20.3,23.18 19.73,22.6 19.73,21.5 R8.1 19.52,20.95 19.07,20.95 18.52,20.4 18.07,20.4 C26.2 v18.07,19.12 | CON12.2 17.57,1.25 | 17.57,1.25 21.6,1.25 22.8,2.45 22.8,4.75 22.55,5 22.55,10.6 20.1,13.05 20.1,15.35 19.2,16.25 v19.2,16.4 | 17.57,1.25 16.33,2.49 CON3.2
  Bottom 0.2: v18.07,19.12 18.07,17.52 v19.2,16.4
TX  (via drill 0.3)
  Top 0.2: 18.85,28.5 IC1.8 19.15,27.1 18.66,26.61 IC3.4 17.03,26.61 16.2,25.77 v16.2,25.32
  Bottom 0.2: v16.2,25.32 16.52,25 17.1,25 17.1,24.35 SJ5.1
VDD_3V3  (via drill 0.3)
  Top 0.2: C16.2 27.27,26.07 R1.2 | R8.2 18.07,20.95 14.62,20.95 14.35,20.68 12.93,20.68 v12.93,20.57
  Top 0.3: IC1.17 27.95,28.5 C17.2 C16.2
  Top 0.4: C15.2 C14.2 17.75,27.95 17.3,27.5 16.43,27.5 15.35,26.43 15.35,25.5 14.35,24.5 14.35,23.1 14.04,22.8 IC3.8 | IC1.17 v26.6,28.5 v26.05,28.5 v25.5,28.5 22.3,28.5 20.9,29.9 20.9,30.9 | C13.2 18.75,34.12 IC1.1 19.9,34.1 20.9,33.1 20.9,30.9 | 17.75,29.85 C15.2 | 20.9,30.9 IC1.5 18.43,30.9 17.75,30.23 C15.2 | 34.85,30.32 v34.88,30.32 v34.88,30.88 v34.88,31.4 36.12,31.4 IC6.5 35.6,31.45 C23.2 35.6,32.95 35.17,33.4 35.17,34.7 35.45,34.98 v36.17,34.98 IC7.5 C24.2 37.73,38.23 PAD3.P$1
  Bottom 0.4: v25.5,28.5 v26.05,28.5 v26.6,28.5 31.9,28.5 33.73,30.32 v34.88,30.32 v34.88,31.4 | TP3.P$1 36,34.98 v36.17,34.98
  other vias: 11.82,20.57 12.38,20.57
  pour Top (no thermals): 11.65,23 11.65,20.35 13.18,20.35 13.18,22.6 13.72,22.6 13.72,23
  pour Bottom (no thermals): 13.12,20.8 13.12,18.05 11.65,18.05 11.65,20.8
VDD_12V  (via drill 0.3)
  Top 0.3: C202.2 36.5,23.07 v36.5,23.52
  Top 0.5: IC101.5 42.98,23 42.58,23.4 41.4,23.4 v41.23,23.57 v40.67,23.57
  Top 1: MODULE1.OUT+@2 MODULE1.OUT+@1 5.6,18.98 SJ1.1 6.95,18.98 6.95,20.12 7.7,20.88 8.38,20.88
  Bottom 1: IC301.5 10.9,22.82 9,20.93 8.35,20.93
  other vias: 35.95,23.52 35.95,22.12 36.5,22.12 29.2,23.52 29.75,23.52 29.2,22.12 29.75,22.12 8.05,20.57 8.6,20.57 8.6,21.12 8.05,21.12
  pour Top (no thermals): 35.75,21.95 38.55,21.95 38.55,23.7 35.75,23.7
  pour Top (no thermals): 42.48,22.43 44.75,22.43 44.75,23.55 42.48,23.55
  pour Top (no thermals): 29,21.95 31.8,21.95 31.8,23.7 29,23.7
  pour Bottom (no thermals): 41.4,23.7 41.4,22.5 36.8,22.5 36.8,21.9 35.7,21.9 35.7,22.5 30,22.5 30,21.95 29,21.95 29,23.7
  pour Top (no thermals): 7.57,20.2 7.57,21.25 8.73,21.25 8.73,20.2
  pour Bottom (no thermals): 8.95,21.4 8.95,20.45 7.93,20.45 7.93,21.4
VDD_24V  (via drill 0.3)
  Top 0.2: MODULE1.IN+@1 22.5,16.1
  Top 0.406: D5.C 10.05,22.1 10.05,22.05
  Top 0.55: R10.1 20.5,18.82 19.7,18.02 19.7,17.68
  Top 1: CON14.7 41.67,38 41.62,38.05 | CON13.7 8.45,26 8.45,26.15 | SJ3.1 10.12,17.98 7.65,15.5 7.65,10.5 CON15.2
  Top 1.5: LED_ANODE.P$1 25,3.88 23.65,5.53 23.65,11.19 MODULE1.IN+@2 MODULE1.IN+@1 19.7,17.68 17.05,17.68 16.02,18.7 10.12,18.7 SJ3.1 10.12,22.05 10.05,22.05 10.05,25.27 v9.1,26.23
  Top 2.5: CON4.1 25,0.02
  Bottom 1.65: v42.05,38.52 41.6,38.95 8.88,38.95 8.4,38.48 8.4,26.23 v8,26.23
  other vias: 8.55,26.77 8,26.77 9.1,26.77 40.4,39.08 40.95,39.08 41.5,39.08 7.45,26.77 9.65,26.77 8.55,25.68 9.1,25.68 42.05,39.08 42.6,39.08 40.4,37.98 40.95,37.98 41.5,37.98 42.05,37.98 42.6,37.98 8.55,26.23 9.65,25.68 7.45,26.23 9.65,26.23 40.4,38.52 40.95,38.52 41.5,38.52 42.6,38.52 8,25.68 7.45,25.68 27.32,3.02 27.88,3.02 28.43,3.02 28.98,3.02 29.52,3.02 30.07,3.02 27.32,2.48 27.88,2.48 28.43,2.48 28.98,2.48 29.52,2.48 30.07,2.48 34.73,3.02 35.27,3.02 35.83,3.02 36.38,3.02 36.92,3.02 37.48,3.02 34.73,2.48 35.27,2.48 35.83,2.48 36.38,2.48 36.92,2.48 37.48,2.48 42.12,3.02 42.67,3.02 43.23,3.02 43.77,3.02 44.33,3.02 44.88,3.02 42.12,2.48 42.67,2.48 43.23,2.48 43.77,2.48 44.33,2.48 44.88,2.48 26.77,3.02 26.77,2.48 25.52,15.97 25.52,15.43 24.98,15.97 24.98,15.43 41.27,15.97 41.27,15.43 40.73,15.97 40.73,15.43 33.38,15.97 33.38,15.43 32.83,15.97 32.83,15.43
  pour Top (no thermals): 7.15,25.5 7.15,26.95 10,26.95 10,25.5
  pour Bottom (no thermals): 9.82,25.5 9.82,26.95 6.6,26.95 6.6,25.5
  pour Top (no thermals): 40.05,37.3 40.05,39.75 43.35,39.75 43.35,37.3
  pour Bottom (no thermals): 43.4,37.3 43.4,39.75 40.05,39.75 40.05,37.3
  pour Bottom (no thermals): 24.1,0.32 24.1,4.9 25.9,4.9 25.9,3.2 45.12,3.2 45.12,0.32
  pour Top (no thermals): 30.32,0.2 23.82,0.2 23.82,3.2 30.35,3.2
  pour Top (no thermals): 37.73,0.32 34.48,0.32 34.48,3.2 37.73,3.2
  pour Top (no thermals): 45.12,0.32 41.88,0.32 41.88,3.2 45.12,3.2
  pour Top (no thermals): 21.05,16.15 25.7,16.15 25.7,15.25 21.05,15.25
  pour Top (no thermals): 38.8,16.15 41.45,16.15 41.45,15.25 38.8,15.25
  pour Top (no thermals): 30.9,16.15 33.55,16.15 33.55,15.25 30.9,15.25
  pour Bottom: 24.8,15.25 41.45,15.25 41.45,16.15 24.8,16.15
  pour Top (no thermals): 11,19.77 9.47,19.77 9.47,17.5 11,17.5
VIN_SENSE
  Top 0.2: IC1.11 22.2,26.25 20.8,24.85 20.8,22.4 20.5,22.1 C18.2 R13.2 | 20.32,20.52 R13.2 | R10.2 21.95,19.8 21.52,19.8 20.98,20.35 20.5,20.35 R13.2

### Text on the board
tPlace: RST | IO | CLK | PIXEL32 | TEMP
bPlace: GND | 24V | CS | A | CLK | B | IN | DAT | DAT | OUT | B | CLK | A | CS | TERM | GND | I measure | j3qq4hch@gmail.com | d.e.palamarchuk@gmail.com | A | C1 | C2 | C3
Document: Board should not be bigger than 50x50mm and no more than 2 layers
DrillLegend: LAYER-STACK
DrillLegend_01-16: 01-16
DrillLegend_01-20: 01-20